# EasyEDA Pro project ProProject_aDataFlow_v2_pub_2024-01-13.epro, board PCB_main_2.51
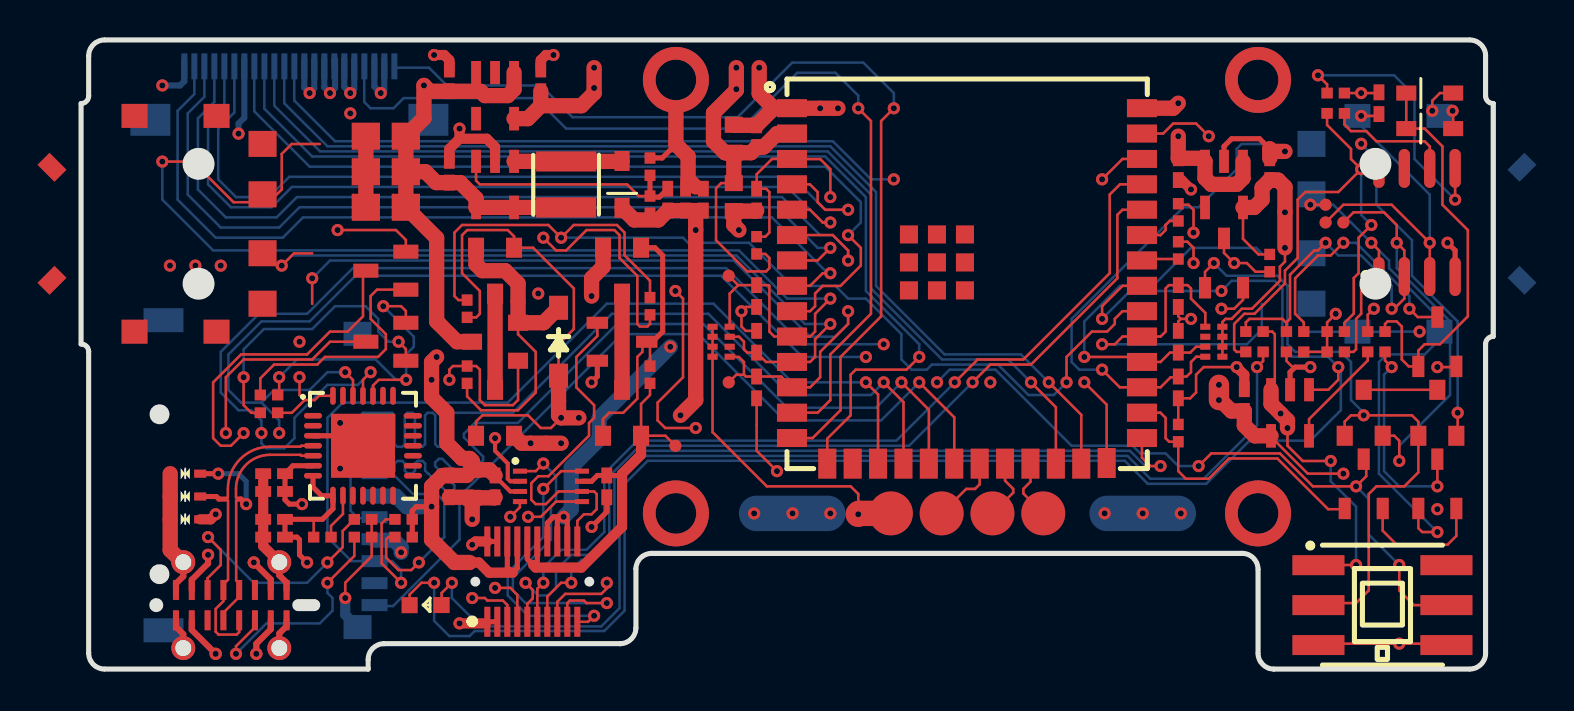
[diagram p11: board, top side]
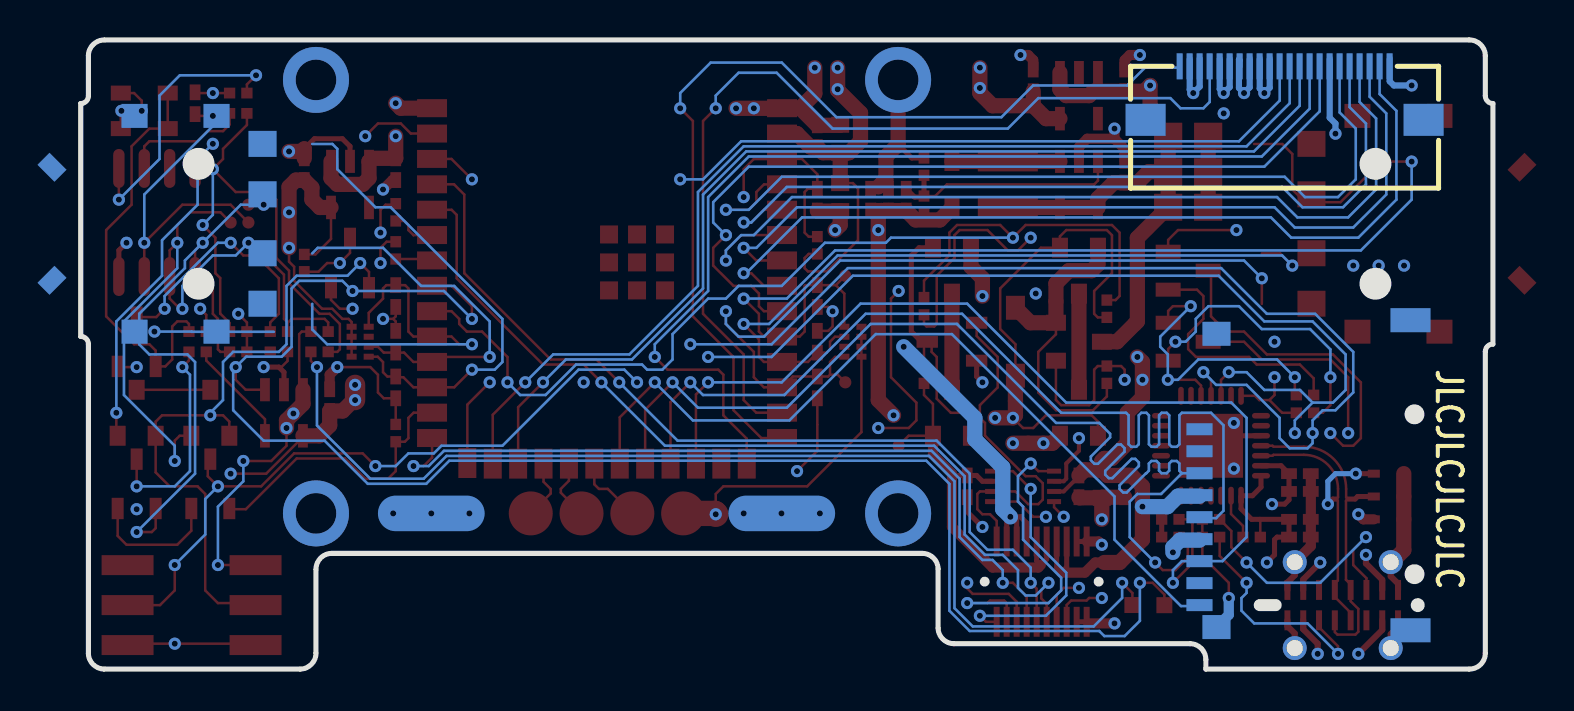
[diagram p12: board, bottom side, seen from below]

Outline 70.61 x 31.49 mm; copper layers: Top Layer, Inner1, Inner2, Bottom Layer. Coordinates in mm from the lower left corner of the outline.
Outline path: 0,28.31 0,16.27 arc(0.27,16.15) 0.38,15.89 0.38,0.79 arc(0.61,0.23) 1.17,0 14.36,0 14.36,0.48 arc(14.59,1.04) 15.15,1.27 26.95,1.27 arc(27.51,1.5) 27.74,2.06 27.74,5 arc(27.98,5.56) 28.54,5.79 58.06,5.79 arc(58.62,5.56) 58.85,5 58.85,0.79 arc(59.08,0.23) 59.65,0 69.44,0 arc(70,0.23) 70.23,0.79 70.23,16.27 arc(70.34,16.54) 70.61,16.65 70.61,28.31 arc(70.34,28.42) 70.23,28.69 70.23,30.69 arc(70,31.25) 69.44,31.49 1.17,31.49 arc(0.61,31.25) 0.38,30.69 0.38,28.69 arc(0.27,28.42) 0,28.31
Stack: Top Layer 0.035mm 外层铜厚1oz / Dielectric1 0.2104mm 7628 RC49% 8.6mil / Inner1 0.0152mm 内层铜厚 / Dielectric2 1.065mm 1.1mm H/HOZ 含铜 / Inner2 0.0152mm 内层铜厚 / Dielectric3 0.2104mm 7628 RC49% 8.6mil / Bottom Layer 0.035mm 外层铜厚1oz

## Design rules (mm)
net USB_DN: DP1
net USB_DP: DP1
template: JLCPCB Capability(Two Layers Board)
spacing copperThickness1oz (default): track to track 0.102, other pairs 0.152 to 0.3
spacing copperThickness2oz: track to track 0.203, other pairs 0.152 to 0.3
track width copperThickness1oz (default): min 0.127, default 0.254, max 2.54
track width copperThickness2oz: min 0.203, default 0.254, max 2.54
differential pair differentialPair (default): width min 0.127, default 0.254, max 2.54; gap min 0.152, default 0.152
via viaSize (default): diameter min 0.5, default 0.61, max 10; hole min 0.3, default 0.305, max 6.3

## Placement (name value [footprint] x y rotation side)
C1  10uF  [C0603]  32.64 26.54 270 top
C2  10uF  [C0603]  32.64 23.62 90 top
C3  100nF  [C0402]  33.78 26.67 270 top
C4  1uF  [C0402]  58.17 13.46 270 top
C5  1uF  [C0402]  33.78 23.5 270 top
C6  10uF  [C0603]  19.56 9.27 90 top
C7  100nF  [C0402]  18.42 9.14 90 top
C8  4.7uF  [C0402]  64.9 28.32 90 top
C9  100nF  [C0402]  54.86 18.67 270 top
C10  100nF  [C0402]  54.86 16.38 90 top
C11  100nF  [C0402]  54.86 14.1 270 top
C12  4.7uF  [C0402]  9.65 9.78 180 top
C13  100nF  [C0402]  9.65 8.89 180 top
C14  1uF  [C0402]  9.65 6.6 180 top
C15  100nF  [C0402]  9.65 7.49 180 top
C16  100nF  [C0402]  33.78 14.1 270 top
C17  100nF  [C0402]  33.78 16.38 90 top
C18  100nF  [C0402]  33.78 18.67 270 top
C19  100nF  [C0402]  20.7 9.14 270 top
C20  100nF  [C0402]  26.29 9.14 90 top
C21  47uF  [C0805]  15.24 23.11 0 top
C22  47uF  [C0805]  15.24 24.89 0 top
C23  47uF  [C0805]  15.24 26.67 0 top
C24  4.7uF  [C0402]  18.42 24.89 270 top
C25  22pF  [C0402]  29.34 23.5 270 top
C26  4.7uF  [C0402]  31.11 23.5 270 top
C27  4.7uF  [C0402]  30.23 23.5 270 top
C28  1uF  [C0402]  54.86 25.02 270 top
C29  1uF  [C0402]  18.42 29.46 90 top
C30  1uF  [C0402]  59.44 25.02 270 top
C31  1uF  [C0402]  22.99 29.46 270 top
CARD1  TF-01A  [TF-SMD_TF-01A]  9.4 9.7 90 bottom
CN1  X0509WVS-20AS-LPV01  [CONN-SMD_20P-P0.50_XKB_X0509WVS-20ADS-LPV01]  22.56 4.38 0 top
D1  1N5819WS  [SOD-323_L1.8-W1.3-LS2.5-RD]  67.44 28.83 0 top
D2  1N5819WS  [SOD-323_L1.8-W1.3-LS2.5-RD]  67.44 27.05 0 top
D3  LESD5D5.0CT1G  [SOD-523_L1.2-W0.8-LS1.6-BI]  5.21 9.78 180 top
D4  LESD5D5.0CT1G  [SOD-523_L1.2-W0.8-LS1.6-BI]  5.21 8.64 180 top
D5  LESD5D5.0CT1G  [SOD-523_L1.2-W0.8-LS1.6-BI]  5.21 7.49 180 top
D6  B5819W SL  [SOD-123_L2.7-W1.6-LS3.7-RD-1]  23.88 16.38 270 top
D7  1N5819WS  [SOD-323_L1.8-W1.3-LS2.5-RD]  27.05 24.26 90 top
FPC1  AFC01-S22FCA-00  [FPC-SMD_P0.5-22P_FGS-XJ-H2.0]  10.42 28.83 0 bottom
L1  10uH  [IND-SMD_L3.0-W3.0_SWPA3010S]  24.26 24.26 270 top
LDO1  ME6211C33M5G-N  [SOT-23-5_L3.0-W1.7-P0.95-LS2.8-BL]  57.15 24.26 180 top
LDO2  ME6211C33M5G-N  [SOT-23-5_L3.0-W1.7-P0.95-LS2.8-BL]  20.7 28.7 180 top
LED1  KT-0603R  [LED0603-RD]  17.23 3.2 0 top
NOREF  -  [Pad_e7534]  6.73 0.76 0 top
NOREF#2  -  [Pad_e9575]  62.23 23.24 0 top
NOREF#3  -  [Pad_e7532]  6.35 5.72 0 top
NOREF#4  -  [Pad_e7497]  25.02 28.19 0 top
NOREF#5  -  [Pad_e7547]  31.62 26.42 0 top
NOREF#6  -  [Pad_e8831]  32.39 19.69 0 top
NOREF#7  -  [Pad_e7535]  8.76 0.76 0 top
NOREF#8  -  [Pad_e93]  35.56 7.79 0 top
NOREF#9  -  [Pad_e7499]  30.73 13.46 0 top
NOREF#10  -  [Pad_e7533]  8.64 5.33 0 top
NOREF#11  -  [Pad_e8787]  32.39 14.35 0 top
NOREF#12  -  [Pad_e7548]  54.86 25.56 0 top
NOREF#13  -  [Pad_e9576]  63.12 22.35 0 top
NOREF#14  -  [Pad_e9577]  62.23 22.35 0 top
NOREF#15  -  [Pad_e84]  53.09 7.79 0 top
NOREF#16  -  [Pad_e7501]  23.88 13.42 0 top
NOREF#17  -  [Pad_e7519]  23.24 11.3 0 top
NOREF#18  -  [Pad_e7496]  17.91 17.27 0 top
NOREF#19  -  [Pad_e7505]  21.85 18.4 0 top
NOREF#20  -  [Pad_e71]  18.29 12.83 0 top
NOREF#21  -  [Pad_e115]  29.72 11.18 0 top
Q1  AO3401A  [SOT-23_L2.9-W1.3-P1.90-LS2.4-BR]  64.14 12.83 270 top
Q2  AO3401A  [SOT-23_L2.9-W1.3-P1.90-LS2.4-BR]  67.82 12.83 270 top
Q3  AO3400A  [SOT-23-3_L2.9-W1.6-P1.90-LS2.8-BR]  67.82 9.27 270 top
Q4  AO3400A  [SOT-23-3_L2.9-W1.6-P1.90-LS2.8-BR]  67.82 16.38 270 top
Q5  SS8050  [SOT-23-3_L2.9-W1.3-P1.90-LS2.4-BR]  15.24 19.94 0 top
Q6  SS8050  [SOT-23-3_L2.9-W1.3-P1.90-LS2.4-BR]  15.24 16.38 0 top
Q7  AO3401A  [SOT-23_L2.9-W1.3-P1.90-LS2.4-BR]  27.05 12.83 270 top
Q8  AO3401A  [SOT-23_L2.9-W1.3-P1.90-LS2.4-BR]  27.05 19.94 90 top
Q9  AO3401A  [SOT-23_L2.9-W1.3-P1.90-LS2.4-BR]  20.7 16.38 0 top
Q10  AO3401A  [SOT-23_L2.9-W1.3-P1.90-LS2.4-BR]  20.7 12.83 270 top
Q11  AO3401A  [SOT-23_L2.9-W1.3-P1.90-LS2.4-BR]  20.7 19.94 90 top
Q12  AO3400A  [SOT-23-3_L2.9-W1.6-P1.90-LS2.8-BR]  27.05 16.38 180 top
Q13  AO3400A  [SOT-23-3_L2.9-W1.6-P1.90-LS2.8-BR]  64.14 9.27 270 top
Q14  AO3400A  [SOT-23-3_L2.9-W1.6-P1.90-LS2.8-BR]  57.15 20.32 270 top
R1  10kΩ  [R0402]  33.78 21.21 270 top
R2  510Ω  [R0402]  54.86 22.86 90 top
R3  10kΩ  [R0402]  16.13 7.49 0 top
R4  100kΩ  [R0402]  58.67 16.89 0 top
R5  510Ω  [R0402]  54.86 20.95 270 top
R6  10kΩ  [R0402]  16.13 6.6 0 top
R7  5.1kΩ  [R0402]  64.77 15.88 0 top
R8  100kΩ  [R0402]  60.71 16.89 180 top
R9  1kΩ  [R0402]  58.67 15.88 0 top
R10  10kΩ  [R0402]  64.77 16.89 0 top
R11  47kΩ  [R0402]  62.74 15.88 0 top
R12  10kΩ  [R0402]  9.4 13.72 180 top
R13  10kΩ  [R0402]  62.74 27.81 0 top
R14  5.1kΩ  [R0402]  14.1 6.6 0 top
R15  10kΩ  [R0402]  62.74 28.83 180 top
R16  5.1kΩ  [R0402]  14.1 7.49 180 top
R17  10kΩ  [R0402]  9.4 12.83 180 top
R18  4.7kΩ  [R0402]  62.74 16.89 180 top
R19  6.8kΩ  [R0402]  60.71 15.88 180 top
R20  10kΩ  [R0402]  12.06 6.6 0 top
R21  10kΩ  [R0402]  28.45 14.73 270 top
R22  300kΩ  [R0402]  28.45 23.24 270 top
R23  10kΩ  [R0402]  19.3 14.73 270 top
R24  1kΩ  [R0402]  19.3 18.03 90 top
R25  1.5kΩ  [R0402]  28.45 18.16 270 top
R26  100kΩ  [R0402]  28.45 25.15 90 top
R27  10kΩ  [R0402]  59.44 20.32 270 top
R28  10kΩ  [R0402]  54.86 11.81 270 top
RN1  10kΩ  [RES-ARRAY-SMD_0402-8P-L2.0-W1.0-BL]  56.64 16.38 270 top
RN2  10kΩ  [RES-ARRAY-SMD_0402-8P-L2.0-W1.0-BL]  32 16.38 90 top
SW1  XKB5858-Z-TP-75  [SW-SMD_6P-L5.8-W5.8-P2.00-LS8.3]  65.07 3.2 0 top
U1  ESP32-S3-WROOM-1U-N4R2  [WIRELM-SMD_ESP32-S3-WROOM-1U]  44.3 19.18 0 top
U2  TP4054-42-SOT25R  [SOT-23-5_L3.0-W1.7-P0.95-LS2.8-BL]  60.45 12.83 180 top
U3  LM393DR2G  [SOIC-8_L5.0-W4.0-P1.27-LS6.0-BL]  66.8 22.35 0 top
U4  SIQ-02FVS3  [SW-SMD_SIQ-02FVS3_1]  66.79 22.29 90 bottom
U5  CP2102-GMR  [WQFN-28_L5.0-W5.0-P0.50-BL-EP3.2]  14.1 11.18 270 top
U6  SIQ-02FVS3  [SW-SMD_SIQ-02FVS3_1]  3.81 22.29 90 top
U7  TXS0102DCUR  [VSON8_L2.0-W2.3-P0.50-LS3.1-BL]  23.49 9.14 270 top
U8  YTC1P-4020-01  [TESTPOINT-SMD_BD2.0_YTC1P-4020-01]  40.49 7.79 0 top
U9  YTC1P-4020-01  [TESTPOINT-SMD_BD2.0_YTC1P-4020-01]  43.03 7.79 0 top
U10  YTC1P-4020-01  [TESTPOINT-SMD_BD2.0_YTC1P-4020-01]  45.57 7.79 0 top
U11  TPS61040DBVR  [SOT-23-5_L3.0-W1.7-P0.95-LS2.8-BL]  20.7 24.26 180 top
U12  YTC1P-4020-01  [TESTPOINT-SMD_BD2.0_YTC1P-4020-01]  48.11 7.79 0 top
USB1  GT-USB-7051A  [USB-C-SMD_GT-USB-7051A]  7.51 3.2 0 top

## Footprints (pads in the part's own frame, mm; a bottom-side part is the same pattern mirrored in y, then rotated)
C0402
  rect 0.79x0.54 smd: 1(-0.545,0) 2(0.545,0)
C0603
  rect 0.8x0.9 smd: 1(-0.7,0) 2(0.7,0)
C0805
  rect 1.41x1.35 smd: 1(-1,0) 2(1,0)
CONN-SMD_20P-P0.50_XKB_X0509WVS-20ADS-LPV01
  rect 0.3x1.5 smd: 1(-2.25,-2.01) 2(-2.25,2.01) 3(-1.75,-2.01) 4(-1.75,2.01) 5(-1.25,-2.01) 6(-1.25,2.01) 7(-0.75,-2.01) 8(-0.75,2.01) 9(-0.25,-2.01) 10(-0.25,2.01) 11(0.25,-2.01) 12(0.25,2.01) 13(0.75,-2.01) 14(0.75,2.01) 15(1.25,-2.01) 16(1.25,2.01) 17(1.75,-2.01) 18(1.75,2.01) 19(2.25,-2.01) 20(2.25,2.01)
FPC-SMD_P0.5-22P_FGS-XJ-H2.0
  rect 0.3x1.3 smd: 1(-5.252,-1.338) 2(-4.752,-1.338) 3(-4.252,-1.338) 4(-3.752,-1.338) 5(-3.252,-1.338) 6(-2.752,-1.338) 7(-2.252,-1.338) 8(-1.752,-1.338) 9(-1.25,-1.339) 10(-0.752,-1.338) 11(-0.252,-1.338) 12(0.248,-1.338) 13(0.748,-1.338) 14(1.248,-1.338) 15(1.748,-1.338) 16(2.248,-1.338) 17(2.748,-1.338) 18(3.248,-1.338) 19(3.748,-1.338) 20(4.25,-1.339) 21(4.748,-1.338) 22(5.248,-1.338)
  rect 2x1.6 smd: 23(6.95,1.339) 24(-6.95,1.339)
IND-SMD_L3.0-W3.0_SWPA3010S
  rect 1x3 smd: 1(1.15,0) 2(-1.15,0)
LED0603-RD
  rect 0.8x0.8 smd: 1(-0.799,-0.004) 2(0.799,0.004)
Pad_e71
  round 0.61 smd: TP1(0,0)
Pad_e84
  oval 5.334x1.778 smd far side: 42(0,0)
Pad_e93
  oval 5.334x1.778 smd far side: 42(0,0)
Pad_e115
  round 0.61 smd: TP5(0,0)
Pad_e7496
  round 0.61 smd: TP2(0,0)
Pad_e7497
  round 0.61 smd: TP3(0,0)
Pad_e7499
  round 0.61 smd: TP5(0,0)
Pad_e7501
  round 0.61 smd: TP7(0,0)
Pad_e7505
  round 0.61 smd: TP8(0,0)
Pad_e7519
  round 0.61 smd: TP10(0,0)
Pad_e7532
  round 0.61 smd: TP16(0,0)
Pad_e7533
  round 0.61 smd: TP17(0,0)
Pad_e7534
  round 0.61 smd: TP18(0,0)
Pad_e7535
  round 0.61 smd: TP19(0,0)
Pad_e7547
  round 0.61 smd: TP31(0,0)
Pad_e7548
  round 0.61 smd: TP32(0,0)
Pad_e8787
  round 0.61 smd: TP22(0,0)
Pad_e8831
  round 0.61 smd: TP25(0,0)
Pad_e9575
  round 0.61 smd: TP1(0,0)
Pad_e9576
  round 0.61 smd: TP2(0,0)
Pad_e9577
  round 0.61 smd: TP3(0,0)
R0402
  rect 0.566x0.54 smd: 1(-0.433,0) 2(0.433,0)
RES-ARRAY-SMD_0402-8P-L2.0-W1.0-BL
  rect 0.3x0.505 smd: 1(-0.75,0.427) 2(-0.25,0.427) 3(0.25,0.427) 4(0.75,0.427) 5(0.75,-0.427) 6(0.25,-0.427) 7(-0.25,-0.427) 8(-0.75,-0.427)
SOD-123_L2.7-W1.6-LS3.7-RD-1
  rect 1.2x0.95 smd: 1(-1.7,0) 2(1.7,0)
SOD-323_L1.8-W1.3-LS2.5-RD
  rect 1x0.75 smd: 1(-1.173,0) 2(1.173,0)
SOD-523_L1.2-W0.8-LS1.6-BI
  rect 0.6x0.4 smd: 1(-0.75,0) 2(0.75,0)
SOIC-8_L5.0-W4.0-P1.27-LS6.0-BL
  oval 0.569x1.95 smd: 1(-1.905,-2.705) 2(-0.635,-2.705) 3(0.635,-2.705) 4(1.905,-2.705) 5(1.905,2.705) 6(0.635,2.705) 7(-0.635,2.705) 8(-1.905,2.705)
SOT-23-3_L2.9-W1.3-P1.90-LS2.4-BR
  rect 1.25x0.7 smd: 1(1,-0.95) 2(1,0.95) 3(-1,0)
SOT-23-3_L2.9-W1.6-P1.90-LS2.8-BR
  rect 1.07x0.6 smd: 1(1.235,-0.95) 2(1.235,0.95) 3(-1.235,0)
SOT-23-5_L3.0-W1.7-P0.95-LS2.8-BL
  rect 0.49x1.157 smd: 1(-0.95,-1.153) 2(0,-1.153) 3(0.95,-1.153)
  rect 0.49x1.175 smd: 4(0.95,1.153) 5(-0.95,1.153)
SOT-23_L2.9-W1.3-P1.90-LS2.4-BR
  rect 1x0.8 smd: 1(1.15,-0.95) 2(1.15,0.95) 3(-1.15,0)
SW-SMD_6P-L5.8-W5.8-P2.00-LS8.3
  rect 2.6x1 smd: 1(-3.2,2) 2(-3.2,0) 3(-3.2,-2) 4(3.2,2) 5(3.2,0) 6(3.2,-2)
SW-SMD_SIQ-02FVS3_1
  rect 1.2x1.3 smd: 1(5.4,-2.964) 2(5.4,1.136) 5(-5.4,1.136) 6(-5.4,-2.964)
  rect 0.85x1.2 smd rot 135: 3(2.829,5.264)
  rect 0.85x1.2 smd rot 45: 4(-2.829,5.264)
  rect 1.3x1.4 smd: A(-4,-5.264) B(4,-5.264) C(1.475,-5.264) S(-1.475,-5.264)
TESTPOINT-SMD_BD2.0_YTC1P-4020-01
  round 2.2 smd: 1(0,0)
TF-SMD_TF-01A
  rect 0.6x1.3 smd: 1(2.3,5.276) 2(1.2,5.276) 3(0.101,5.276) 4(-1,5.276) 5(-2.099,5.276) 6(-3.2,5.276) 7(-4.3,5.276) 8(-5.399,5.276) 9(-6.5,5.276)
  rect 1.2x1.4 smd: 10(-7.599,4.426) 13(7.08,4.426)
  rect 1.2x2 smd: 11(-7.76,-5.276) 12(7.76,-5.276)
USB-C-SMD_GT-USB-7051A
  round 1.2 hole 0.8: 0(-2.4,2.15) 0(-2.4,-2.15) 0(2.4,2.15) 0(2.4,-2.15)
  rect 0.3x1 smd: A1(-2.765,0.76) A4(-1.975,0.76) A5(-1.185,0.76) A6(-0.395,0.76) A7(0.395,0.76) A8(1.185,0.76) A9(1.975,0.76) A12(2.765,0.76) B1(2.765,-0.76) B4(1.975,-0.76) B5(1.185,-0.76) B6(0.395,-0.76) B7(-0.395,-0.76) B8(-1.185,-0.76) B9(-1.975,-0.76) B12(-2.765,-0.76)
VSON8_L2.0-W2.3-P0.50-LS3.1-BL
  rect 0.25x0.7 smd: 1(-0.762,-1.55) 2(-0.254,-1.55) 3(0.254,-1.55) 4(0.762,-1.55) 5(0.762,1.55) 6(0.254,1.55) 7(-0.254,1.55) 8(-0.762,1.55)
WIRELM-SMD_ESP32-S3-WROOM-1U
  rect 1.5x0.9 smd: 1(-8.75,8.895) 2(-8.75,7.625) 3(-8.75,6.355) 4(-8.75,5.085) 5(-8.75,3.815) 6(-8.75,2.545) 7(-8.75,1.275) 8(-8.75,0.005) 9(-8.75,-1.265) 10(-8.75,-2.535) 11(-8.75,-3.805) 12(-8.75,-5.075) 13(-8.75,-6.345) 14(-8.75,-7.615) 27(8.75,-7.615) 28(8.75,-6.345) 29(8.75,-5.075) 30(8.75,-3.805) 31(8.75,-2.535) 32(8.75,-1.265) 33(8.75,0.005) 34(8.75,1.275) 35(8.75,2.545) 36(8.75,3.815) 37(8.75,5.085) 38(8.75,6.355) 39(8.75,7.625) 40(8.75,8.895)
  rect 0.9x1.5 smd: 15(-6.985,-8.895) 16(-5.715,-8.895) 17(-4.445,-8.895) 18(-3.175,-8.895) 19(-1.905,-8.895) 20(-0.635,-8.895) 21(0.635,-8.895) 22(1.905,-8.895) 23(3.175,-8.895) 24(4.445,-8.895) 25(5.715,-8.895) 26(6.985,-8.865)
  rect 0.9x0.9 smd: 41(-2.9,2.575) 41(-2.9,1.175) 41(-2.9,-0.225) 41(-1.5,2.575) 41(-1.5,1.175) 41(-1.5,-0.225) 41(-0.1,2.575) 41(-0.1,1.175) 41(-0.1,-0.225)
WQFN-28_L5.0-W5.0-P0.50-BL-EP3.2
  oval 0.28x0.9 smd: 1(-1.502,-2.5) 2(-1.001,-2.5) 3(-0.5,-2.5) 4(0,-2.5) 5(0.5,-2.5) 6(1,-2.5) 7(1.501,-2.5) 15(1.501,2.5) 16(1,2.5) 17(0.5,2.5) 18(0,2.5) 19(-0.5,2.5) 20(-1.001,2.5) 21(-1.502,2.5)
  oval 0.9x0.28 smd: 8(2.5,-1.502) 9(2.5,-1.001) 10(2.5,-0.5) 11(2.5,0) 12(2.5,0.5) 13(2.5,1) 14(2.5,1.501) 22(-2.5,1.501) 23(-2.5,1) 24(-2.5,0.5) 25(-2.5,0) 26(-2.5,-0.5) 27(-2.5,-1.001) 28(-2.5,-1.502)
  rect 3.2x3.2 smd: 29(0,0)

## Nets
As in the schematic, except:
3V3: C6.2 C7.2 C19.1 C30.2 CARD1.4 CN1.6 CN1.8 FPC1.7 LDO1.5 NOREF#20.TP1 R3.2 R6.2 R27.1 RN1.1 RN1.2 RN1.3 RN1.4 RN2.1 RN2.2 RN2.3 RN2.4 U7.3 U8.1
3V3_2: C1.2 C2.2 C3.2 C31.2 LDO2.5 NOREF#4.TP3 NOREF#5.TP31 R1.2 U1.2
5V_USB: C4.2 C14.1 C15.1 D1.2 D5.1 D6.2 NOREF.TP18 NOREF#3.TP16 NOREF#7.TP19 NOREF#10.TP17 NOREF#16.TP7 Q10.1 Q11.1 R20.1 R24.1 U2.4 U5.7 U5.8 USB1.A4 USB1.A9 USB1.B4 USB1.B9
+5V: C25.2 C26.2 C27.2 CN1.2 CN1.4 D7.1 FPC1.13 FPC1.14 FPC1.15 FPC1.16 NOREF#9.TP5 R22.2
GND: C1.1 C2.1 C3.1 C4.1 C5.2 C6.1 C7.1 C8.2 C9.2 C10.2 C11.2 C12.2 C13.2 C14.2 C15.2 C16.2 C17.2 C18.2 C19.2 C20.1 C21.1 C22.1 C23.1 C24.1 C26.1 C27.1 C28.2 C29.2 C30.1 C31.1 CARD1.6 CARD1.10 CARD1.11 CARD1.12 CARD1.13 CN1.1 CN1.3 D3.2 D4.2 D5.2 FPC1.1 FPC1.17 FPC1.18 FPC1.20 FPC1.21 FPC1.23 FPC1.24 LDO1.2 LDO2.2 NOREF#15.42 Q3.2 Q4.2 Q12.2 Q13.2 Q14.2 R10.1 R14.2 R15.1 R16.1 R19.2 R25.2 R26.2 R28.1 SW1.3 SW1.6 U1.1 U1.40 U1.41 U2.2 U3.4 U4.1 U4.2 U4.3 U4.4 U4.5 U4.6 U4.C U5.3 U5.29 U6.1 U6.2 U6.3 U6.4 U6.5 U6.6 U6.C U7.2 U11.2 USB1.0 USB1.A1 USB1.A12 USB1.B1 USB1.B12
VBAT: NOREF#8.42 NOREF#17.TP10 Q10.2 R4.2 SW1.1 U2.3
VCC: C21.2 C22.2 C23.2 C24.2 C28.1 C29.1 D2.2 L1.1 LDO1.1 LDO1.3 LDO2.1 LDO2.3 NOREF#12.TP32 NOREF#18.TP2 Q9.3 U11.4 U11.5
CHARGE_EN: NOREF#2.TP1 Q3.1 R11.2 U3.1
COMP_BATT: NOREF#13.TP2 Q1.2 R4.1 R8.2 U3.2
ENC_BANDRATE_A: C16.1 NOREF#11.TP22 RN2.8 U1.12 U6.A
ENC_BANDRATE_B: C18.1 NOREF#6.TP25 RN2.5 U1.10 U6.B
VOUT_PRE: C20.2 CN1.10 CN1.12 NOREF#21.TP5 Q7.2 R21.2 U7.7
$1N2499: D6.1 NOREF#19.TP8 Q9.2 Q11.2 R23.2
$1N99677: C8.1 NOREF#14.TP3 R11.1 R18.2 R19.1 U3.3

Pads without a net: CARD1 1 2 8; LDO1 4; LDO2 4; RN1 7; RN2 7; SW1 4; U1 16; U3 7; U5 1 2 10 11 12 13 14 15 16 17 18 19 20 21 22 23 27; USB1 A8 B8

## Via types
v1: diameter 0.61, hole 0.305, Top Layer to Bottom Layer, 197 vias
v2: diameter 3.302, hole 2.032, Top Layer to Bottom Layer, 4 vias

## Routing (per net, layer and track width the routed paths; a pad name or vN(x,y) marks a point on that pad's centre or on a via; arc(x,y) is an arc through that point)
3V3: length 168.2
  Top Layer w0.127: v1(60.2,21.08) 60.2,20.39 59.94,20.14 59.94,19.43 58.55,18.03 58.04,18.03 57.53,17.53 57.22,17.53 57.07,17.37 RN1.1 RN1.2 RN1.3 RN1.4 ; R27.1 58.88,20.75 58.1,21.53 LDO1.5 ; RN2.4 RN2.3 RN2.2 RN2.1 31.58,11.86 34.29,9.14 38.48,9.14 38.86,8.76 v1(38.86,7.75)
  Top Layer w0.203: U7.3 21.46,8.89 20.7,9.65 C19.1
  Top Layer w0.254: CN1.8 21.81,5.05 21.59,4.83 21.31,5.1 CN1.6 ; R6.2 R3.2 16.56,7.93 16.76,8.13 v1(17.53,8.13)
  Top Layer w0.508: 19.43,5.33 19.89,5.33 20.4,4.83 21.59,4.83
  Top Layer w0.762: v1(60.2,21.08) v1(60.2,22.86) 60.2,24.13 59.85,24.47 C30.2 59.05,24.09 59.05,23.5 58.66,23.1 LDO1.5 ; C6.2 19.56,10.41 19.43,10.54 19.05,10.54 18.29,11.3 NOREF#20.TP1 17.53,13.59 v1(17.53,14.48) 17.53,15.37 v1(17.78,15.62) ; C6.2 20.42,9.97 C19.1 ; C6.2 19.28,9.69 C7.2 18.07,9.69 17.53,9.14 v1(17.53,8.13) 17.53,6.48 18.67,5.33 19.43,5.33
  Top Layer w1.27: v1(38.86,7.75) 38.9,7.79 U8.1
  Inner2 w0.762: v1(7.87,26.8) 10.41,26.8 17.07,20.14 ; v1(17.53,14.48) 17.53,15.37 v1(17.78,15.62) 17.78,19.43 17.07,20.14 ; v1(38.86,7.75) 42.19,11.07 61.11,11.07 61.6,11.56 61.6,12.57 59.69,14.48 59.69,20.57 v1(60.2,21.08) v1(60.2,22.86) 60.2,24.13 58.93,25.4 33.78,25.4 31.88,23.5 31.88,21.46 30.56,20.14 17.07,20.14
  Bottom Layer w0.305: v1(7.87,26.8) 7.87,27.31 8.16,27.59 8.16,30.55
  Bottom Layer w0.762: v1(17.53,8.13) 16.28,8.13 15.75,8.65 14.67,8.65
3V3_2: length 36
  Top Layer w0.127: R1.2 34.21,20.78 34.42,20.57 34.42,20.07 34.25,19.9 33.31,19.9 31.75,21.46 31.75,24.07 32,24.32 C2.2
  Top Layer w0.762: LDO2.5 22.34,27.55 22.99,28.19 ; C1.2 32.2,25.84 NOREF#5.TP31 31.62,27.83 32.77,28.97 v1(32.77,29.02) v1(32.77,30.1) ; C1.2 33.5,25.84 C3.2 34.13,26.12 34.8,26.8 U1.2 ; C1.2 C2.2 ; 22.99,28.19 NOREF#4.TP3 25.65,28.83 v1(25.65,30.1) ; 22.99,28.19 C31.2
  Inner2 w0.762: v1(32.77,30.1) v1(32.77,29.02) 30.67,26.92 27.69,26.92 25.65,28.96 v1(25.65,29.08) v1(25.65,30.1)
5V_CHK+: length 52.9
  Top Layer w0.127: 19.3,18.47 18.87,18.47 18.67,18.67 18.67,21.84 19.05,22.23 23.37,22.23 v1(24,21.59) 24.64,22.23 26.8,22.23 27.18,21.84 27.18,20.71 28.45,19.44 R25.1 ; v1(49.28,14.35) 49.28,15.62 50.55,16.89 51.31,16.89 51.69,17.27 51.69,17.53 52.08,17.91 U1.32
  Bottom Layer w0.127: v1(49.28,14.35) 48.64,13.72 47.37,13.72 45.85,15.24 42.55,15.24 42.29,14.99 41.53,14.99 41.02,15.49 41.02,16.76 39.24,18.54 38.35,18.54 37.72,19.18 35.56,19.18 33.4,21.34 30.35,21.34 30.1,21.59 v1(24,21.59)
5V_USB: length 166.7
  Top Layer w0.127: v1(24,12.57) 23.49,12.06 22.99,12.06 22.35,12.7 20.07,12.7 19.75,12.39 19.75,11.68 ; v1(67.56,27.94) 67.56,28.45 67.95,28.83 D1.2 ; R24.1 19.76,17.6 19.94,17.78 19.94,18.92 19.05,19.81 19.05,21.72 19.3,21.97 21.34,21.97 21.65,21.66 Q11.1 22.6,21.09 24.64,19.05 24.64,17.02 23.88,16.26 D6.2 ; v1(63.12,9.78) 61.34,9.78 59.5,11.62 U2.4 ; 11.65,7.49 11.63,7.47 R20.1
  Top Layer w0.254: 12.48,8.68 12.03,8.68 11.6,9.1 U5.7 ; v1(11.3,5.33) 10.92,5.72 10.92,6.48 10.8,6.6 C14.1 C15.1 12.06,7.49 12.6,8.02 U5.8
  Top Layer w0.305: USB1.B9 5.54,1.96 v1(6.73,0.76) ; v1(8.76,0.76) 8.76,1.27 9.49,1.99 USB1.B4 ; USB1.A4 5.54,4.47 6.35,5.28 v1(6.35,5.72) ; v1(8.64,5.33) 9.49,4.48 USB1.A9
  Top Layer w0.508: v1(6.73,7.75) 6.48,7.49 D5.1
  Top Layer w0.762: v1(24.89,12.57) v1(24,12.57) 23.88,12.7 NOREF#16.TP7 D6.2 ; v1(56.9,13.46) 56.97,13.46 57.52,12.92 C4.2 58.17,12.19 58.68,11.67 U2.4
  Top Layer w1.016: v1(56.9,14.22) v1(56.9,13.46)
  Inner2 w0.127: v1(63.12,9.78) 63.12,12.57 60.83,14.86 60.83,20.19 61.47,20.83 61.47,21.72 62.48,22.73 63.75,22.73 67.56,26.54 v1(67.56,27.94)
  Inner2 w0.254: v1(6.73,7.75) 7.62,7.75 8,7.37 9.27,7.37 v1(11.3,5.33)
  Inner2 w0.508: v1(8.64,5.33) 8.64,4.32 7.81,3.49 6.35,4.95 v1(6.35,5.72) ; v1(8.76,0.76) 8.76,1.48 8.34,1.91 7.87,1.91 v1(6.73,0.76)
  Inner2 w1.016: 4.7,7.75 4.7,11.18 6.98,13.46 23.11,13.46 v1(24,12.57) v1(24.89,12.57) 25.91,12.57 28.32,14.99 31.5,14.99 33.27,13.21 56.64,13.21 v1(56.9,13.46) ; 4.7,7.75 v1(6.73,7.75) ; 4.7,7.75 2.77,5.81 arc(2.03,4.72) 1.78,3.43 1.78,2.79 arc(2.15,1.9) 3.05,1.52 3.14,1.52 arc(3.64,1.62) 4.06,1.91 arc(4.91,2.47) 5.9,2.67 7.49,2.67 ; 7.49,2.67 7.87,2.29 7.87,1.91 ; 7.49,2.67 7.81,2.98 7.81,3.49
  Inner2 w1.27: v1(56.9,14.22) v1(56.9,13.46)
+5V: length 62.3
  Top Layer w0.254: CN1.4 CN1.2
  Top Layer w0.508: CN1.2 19.72,6.39 v1(19.56,6.22)
  Top Layer w0.762: 30.58,22.95 30.73,22.8 v1(30.73,21.97) NOREF#9.TP5 v1(29.97,12.7) ; 30.58,22.95 30.82,22.95 ; 30.58,22.95 C27.2 C25.2 28.87,22.48 27.66,22.48 D7.1
  Inner2 w0.508: v1(12.45,28.83) 12.45,28.32 12.15,28.03 11.94,28.03 11.43,28.53 v1(11.43,28.83)
  Inner2 w0.762: v1(29.97,12.7) 26.54,9.27 26.54,6.73 26.04,6.22 v1(19.56,6.22) ; 11.98,28.03 11.98,27.14 14.1,25.02 27.69,25.02 v1(30.73,21.97)
  Bottom Layer w0.305: 11.66,30.55 11.66,29.06 v1(11.43,28.83) 11.16,29.1 11.16,30.55 ; 12.16,30.55 12.16,29.11 v1(12.45,28.83) 12.7,29.08 12.7,30.51 12.67,30.48 FPC1.16
GND: length 138.2
  Top Layer w0.127: C16.2 33.78,10.92 v1(34.8,9.91) ; v1(67.82,15.11) 68.61,15.11 68.77,15.28 ; v1(55.5,17.53) 54.99,17.53 ; 54.99,17.53 54.86,17.4 C10.2 ; 54.99,17.53 54.86,17.65 C9.2 ; Q13.2 65.08,6.92 65.79,6.22 68.33,6.22 68.77,6.67 Q3.2 ; R25.2 28.45,17.27 28.32,17.14 27.94,17.14 27.81,17.27 27.81,19.69 26.92,20.57 26.92,21.72 26.67,21.97 25.27,21.97 24.26,20.95 23.75,20.95 v1(23.11,21.59) ; C8.2 64.86,28.83 v1(64.01,28.83) 63.17,28.83 ; C18.2 33.24,18.12 v1(33.02,17.91) 33.02,17.14 33.24,16.93 C17.2 ; v1(57.79,15.11) 56.13,15.11 55.75,14.73 55.75,13.84 55.46,13.55 C11.2 54.86,12.37 ; 61.7,1.2 61.77,1.27 v1(65.91,1.27) 68.38,1.27 68.45,1.2 ; R10.1 64.34,17.73 v1(64.64,18.03) ; R16.1 R14.2 14.53,5.64 13.21,4.32 v1(13.21,3.56) ; v1(57.02,18.03) 57.66,18.03 58.1,18.48 Q14.2 ; R19.2 60.27,15.42 60.58,15.11 60.71,15.11
  Top Layer w0.203: U7.2 21.46,9.4 21.34,9.53 21.34,10.29 20.7,10.92 v1(20.7,11.56)
  Top Layer w0.254: v1(68.33,21.34) 68.71,20.95 U3.4 ; v1(25.53,14.35) 25.82,14.64 25.82,15.43 ; U5.3 13.6,11.68 U5.29 ; 59.44,26.03 58.93,26.54 57.53,26.54 57.15,26.16 LDO1.2 ; v1(61.47,15.11) 60.71,15.11 60.45,14.86 60.45,13.98 ; 29.74,26.26 29.06,25.58 R26.2 ; v1(25.53,7.11) 26.29,7.87 C20.1 ; CN1.3 CN1.1
  Top Layer w0.305: USB1.A1 4.75,4.28 5.11,4.64 USB1.0 ; USB1.0 9.91,4.69 10.28,4.33 USB1.A12 ; USB1.0 5.11,1.75 4.75,2.11 USB1.B12 ; USB1.B1 10.28,2.15 9.91,1.78 USB1.0
  Top Layer w0.508: C29.2 18.42,30.48 18.16,30.73 v1(17.65,30.73) ; USB1.0 9.11,6.15 9.11,9.78 ; C24.1 18.42,26.03 18.92,26.54 ; v1(18.92,27.05) 18.92,26.54 ; 18.92,26.54 20.29,26.54 20.7,26.13 U11.2 ; C31.1 22.99,30.48 23.24,30.73 v1(23.62,30.73) ; v1(18.92,2.29) 20.23,2.29 ; v1(57.79,15.11) 58.17,14.73 C4.1 ; v1(55.5,24) 55.03,24.47 C28.2
  Top Layer w0.762: C6.1 19.53,8.6 C7.1 ; C6.1 v1(19.56,7.49) ; C6.1 20.67,8.57 C19.2 ; v1(60.2,25.91) 59.56,25.91 59.44,26.03 C30.1 ; 34.64,28.07 U1.1 35.55,28.07 v1(36.96,28.07) v1(37.85,28.07) ; 34.64,28.07 33.91,28.8 v1(33.91,30.1) ; 34.64,28.07 C3.1 32.67,27.22 C1.1 ; v2(29.74,29.49) 29.74,26.26 30.35,25.65 30.35,24.51 30.73,24.13 ; C5.2 33.75,22.92 C2.1 32.64,22.23 v1(32.89,21.97) ; U1.40 54.61,28.07 v1(54.86,28.32) ; USB1.0 5.06,5.35 4.46,5.96 D5.2 D4.2 D3.2 ; C21.1 C22.1 C23.1
  Bottom Layer w0.127: v1(66.93,16.89) 65.07,16.89 65.06,16.88 60.96,16.88
  Bottom Layer w0.305: v1(4.06,29.21) 4.95,29.21 5.16,29.42 5.16,30.55 ; 13.66,30.55 13.66,29.03 v1(13.46,28.83) 13.16,29.13 13.16,30.55 ; 15.16,30.55 15.16,29.01 v1(14.99,28.83) 14.66,29.15 14.66,30.55
  Bottom Layer w0.508: v1(13.21,3.56) 13.21,2.72 CARD1.10
  Bottom Layer w0.762: v1(16,5.84) 16,6.1 15.64,6.45 14.67,6.45
  vias: v1(10.92,16.38) v1(12.95,12.32) v1(12.95,10.03) v1(22.86,18.8) v1(45.47,14.35) v1(51.18,7.79) v1(53.09,7.79) v1(54.99,7.79) v1(67.82,8) v2(29.74,7.79) v2(58.85,29.49) v2(58.85,7.79)
VBAT: length 65.5
  Top Layer w0.127: v1(62.48,10.41) 61.09,10.41 60.33,11.18 v1(60.33,12.06) ; 61.7,5.2 61.7,5.21 v1(63.75,5.21) ; 59.5,13.98 59.69,14.17 59.69,16.76 59.56,16.89 59.11,16.89
  Top Layer w0.762: 59.5,13.98 59.5,13.27 v1(59.98,12.79) 60.33,12.45 v1(60.33,12.06) ; v1(24,11.3) NOREF#17.TP10 v1(22.48,11.3) 22.02,11.3 21.65,11.68
  Inner2 w0.762: v1(60.33,12.06) 60.33,12.45 59.94,12.83 58.04,12.83 57.28,12.06 41.74,12.06 v1(37.46,7.79) v1(35.58,7.79) v1(33.65,7.79) 32.99,8.45 32.99,11.84 30.91,13.92 28.9,13.92 26.29,11.3 v1(24,11.3) v1(22.48,11.3)
  Bottom Layer w0.127: v1(62.48,10.41) 62.48,9.4 63.75,8.13 v1(63.75,5.21)
VCC: length 94.8
  Top Layer w0.127: D2.2 68.61,27.72 68.58,27.75 v1(68.58,27.94)
  Top Layer w0.762: C22.2 C21.2 17.78,21.57 17.78,17.4 NOREF#18.TP2 18.8,16.38 Q9.3 ; C22.2 17.22,24.89 17.76,24.35 C24.2 18.96,24.35 19.75,23.56 U11.4 U11.5 24.25,23.1 L1.1 ; C22.2 C23.2 17.14,27.58 v1(17.14,29.21) 17.44,28.92 C29.1 19.98,28.92 20.19,28.7 21.34,28.7 21.65,29.02 LDO2.1 ; LDO1.1 58.1,24.57 57.79,24.26 56.52,24.26 56.2,24.57 LDO1.3 56.05,25.56 NOREF#12.TP32 v1(54.86,26.67)
  Inner2 w0.127: v1(68.58,27.94) 68.58,28.96 67.95,29.59 63.63,29.59 63.12,29.08 63.12,28.07 62.36,27.31 55.5,27.31 v1(54.86,26.67)
  Inner2 w0.762: v1(17.14,29.21) 17.14,26.42 17.65,25.91 32.37,25.91 33.13,26.67 v1(54.86,26.67)
VCC_3V3_FROM_USB: length 109.8
  Top Layer w0.127: R9.1 57.79,15.88 57.66,16 57.66,17.27 58.17,17.78 58.67,17.78 60.2,19.3 60.2,19.94 60.83,20.57 60.83,23.5 61.21,23.88 62.86,23.88 v1(64.01,25.02) 63.5,25.53 63.5,26.03 62.3,27.23 R13.1 ; 63.17,16.89 63.17,17.32 63.64,17.79 63.64,19.57 63.88,19.81 63.88,21.59 v1(64.52,22.23)
  Top Layer w0.254: v1(64.01,25.02) 64.86,25.02 U3.8 ; v1(11.05,8.26) 10.41,8.26 10.2,8.47 C13.1 C12.1 10.59,10.18 U5.6
  Inner2 w0.254: v1(64.01,25.02) 64.01,23.5 63.63,23.11 62.36,23.11 61.05,21.81 61.05,20.92 60.45,20.32 60.45,14.73 62.36,12.83 62.36,11.3 61.47,10.41 57.4,10.41 56.39,9.4 53.34,9.4 52.32,10.41 42.55,10.41 39.24,7.11 33.4,7.11 32.26,8.26 32.26,11.56 30.51,13.31 29.44,13.31 25.91,9.78 25.91,8.51 24.26,6.86 12.45,6.86 v1(11.05,8.26)
  Bottom Layer w0.127: v1(64.01,25.02) 64.01,22.73 v1(64.52,22.23)
(no net):
  vias: v1(4.44,20.19) v1(5.72,20.19) v1(6.98,20.19) v1(13.46,27.81)
74HC595_DS: length 3.5
  Top Layer w0.127: U9.1 44.26,9.02 44.7,9.02 44.93,9.25 U1.21
74HC595_SHCP: length 3.1
  Top Layer w0.127: U12.1 47.12,8.79 47.12,9.02 47.47,9.37 U1.23
74HC595_STCP: length 3.1
  Top Layer w0.127: U1.22 46.2,9.42 46.61,9.02 46.61,8.83 U10.1
ADC_BATT: length 28.2
  Top Layer w0.127: v1(56.39,26.67) 55.75,27.31 54.61,27.31 54.11,26.8 U1.39 ; 68.77,11.68 68.83,11.74 v1(68.83,12.83)
  Inner2 w0.127: v1(56.39,26.67) 63.63,26.67 v1(64.01,26.29)
  Bottom Layer w0.127: v1(68.83,12.83) 68.83,17.4 66.55,19.69 66.55,21.46 64.77,23.24 64.77,25.53 v1(64.01,26.29)
ADC_BATT_EN: length 33.1
  Top Layer w0.127: 66.87,11.68 66.87,12.38 66.55,12.7 v1(64.14,12.7) 63.5,12.7 63.18,12.39 63.18,11.68 ; 66.87,11.68 66.8,11.61 ; 66.87,11.68 66.87,9.84 66.17,9.14 64.77,9.14 64.39,8.76 64.39,3.94 63.75,3.3 61.8,3.3 61.7,3.2 ; v1(56.64,20.32) 56.2,19.88 Q14.1
  Bottom Layer w0.127: v1(56.64,20.32) 57.28,19.69 59.82,19.69 60.33,19.18 60.33,16.26 60.71,15.88 62.99,15.88 63.5,15.37 63.5,13.46 64.26,12.7
ADC_LIGHT: length 46.4
  Top Layer w0.127: U1.38 52.08,25.53 v1(51.05,24.51)
  Inner2 w0.127: v1(40.64,24.51) 50.93,24.51
  Bottom Layer w0.127: 10.66,30.55 10.66,28.45 12.7,26.42 37.59,26.42 39.5,24.51 v1(40.64,24.51)
BTN_CHART: length 53.7
  Top Layer w0.127: v1(48.39,14.35) 50.01,12.73 U1.25
  Bottom Layer w0.127: 10.16,30.55 10.16,28.32 12.32,26.16 37.46,26.16 39.75,23.88 39.75,19.18 43.18,15.75 46.99,15.75 v1(48.39,14.35)
BTN_REC: length 53.3
  Top Layer w0.127: v1(47.5,14.35) 48.74,13.11 U1.24
  Bottom Layer w0.127: 9.66,30.55 9.66,28.2 11.95,25.91 37.34,25.91 39.5,23.75 39.5,19.05 43.05,15.49 46.36,15.49 v1(47.5,14.35)
BUTTON_CHK: length 20
  Top Layer w0.127: U1.26 51.28,13.23 v1(50.17,14.35) ; 59.44,19.89 58.73,19.89 58.29,20.32 v1(57.66,20.32) 57.15,20.83 Q14.3
  Inner2 w0.127: v1(57.66,20.32) 56.9,19.56 53.09,19.56 51.82,18.29 51.82,14.73 51.43,14.35 v1(50.17,14.35)
CHARGE_CHK+: length 82.6
  Top Layer w0.127: v1(17.65,4.32) 17.02,4.32 16.43,3.73 LED1.1 ; v1(62.86,15.11) 62.86,14.48 62.37,13.98 61.4,13.98 ; U1.33 52.08,19.18 51.05,18.16 v1(51.05,17.53)
  Bottom Layer w0.127: v1(51.05,17.53) 52.45,18.92 v1(57.02,18.92) 57.53,19.43 59.69,19.43 60.07,19.05 60.07,16.13 60.57,15.63 62.34,15.63 v1(62.86,15.11) 62.99,14.99 62.99,12.95 61.47,11.43 58.42,11.43 56.26,9.27 53.34,9.27 52.18,10.43 28.33,10.43 27.18,9.27 27.18,2.92 26.16,1.91 19.68,1.91 19.43,1.65 18.42,1.65 17.65,2.41 v1(17.65,4.32)
CHARGE_EN: length 32.8
  Top Layer w0.127: v1(64.52,21.34) 64.9,20.95 U3.1 64.22,19.65 64.01,19.43 64.01,17.78 63.75,17.53 63.75,16 63.63,15.88 63.17,15.88 ; v1(67.82,6.86) 67.06,6.86 66.87,7.05 66.87,7.91 ; v1(61.47,23.24) NOREF#2.TP1
  Bottom Layer w0.127: v1(61.47,23.24) 62.61,23.24 v1(64.52,21.34) 65.4,20.45 65.4,20.07 67.69,17.78 67.69,16.26 67.18,15.75 65.28,15.75 64.9,15.37 64.9,9.78 v1(67.82,6.86)
COMP_BATT: length 36.1
  Top Layer w0.127: 65.21,11.68 65.67,11.68 65.91,11.43 v1(65.91,10.41) ; R4.1 58.24,17.35 58.42,17.53 60.07,17.53 60.27,17.32 ; NOREF#13.TP2 63.63,22.86 65.15,22.86 65.79,22.23 v1(65.79,21.34) 66.17,20.95 U3.2 66.17,18.54 65.66,18.03 v1(65.53,18.03) ; 60.27,17.32 60.27,17.35 60.45,17.53 60.45,19.74 61.67,20.95 61.85,20.95 v1(62.23,21.34) ; 60.27,17.32 R8.2
  Bottom Layer w0.127: v1(65.79,21.34) 65.79,20.07 68.45,17.4 68.45,13.72 65.91,11.18 v1(65.91,10.41) ; v1(65.53,18.03) 65.53,19.18 64.01,20.7 62.86,20.7 v1(62.23,21.34)
DETECT: length 17.9
  Top Layer w0.127: CN1.20 24.81,7.42 25.15,7.75 25.53,7.75 25.78,8 25.78,8.76 25.65,8.89 U7.6 23.88,8.89 23.24,8.26 22.73,8.26 22.51,8.48 22.51,9.3 22.86,9.65 23.37,9.65 25.4,11.68 25.4,12.32 25.65,12.57 25.65,13.21 24.77,14.1 24.77,15.62 25.82,16.67 Q12.1
EN_EXT: length 32
  Top Layer w0.127: Q6.3 12.45,16.38 11.56,15.49 8.13,15.49 7.24,14.61 v1(7.24,11.81) ; v1(20.7,4.06) 21.46,4.06 21.81,3.71 CN1.7
  Inner2 w0.127: v1(20.7,4.06) 20.7,3.3 20.32,2.92 15.75,2.92 12.7,5.97 11.68,5.97 7.24,10.41 v1(7.24,11.81)
ENC_BANDRATE_A: length 41.4
  Top Layer w0.127: 33.15,14.73 33.15,15.37 32.89,15.62 32.45,15.62 ; 33.15,14.73 33.24,14.64 C16.1 35.01,14.64 U1.12 36.45,14.1 36.96,14.61 36.96,15.88 38.35,17.27 v1(38.35,17.91) ; 33.15,14.73 32.77,14.73 NOREF#11.TP22 ; v1(11.56,19.56) 11.56,18.28
  Bottom Layer w0.127: v1(38.35,17.91) 38.35,17.27 37.72,16.64 36.45,16.64 32.64,20.45 12.45,20.45 v1(11.56,19.56)
ENC_BANDRATE_B: length 59.6
  Top Layer w0.127: v1(4.06,25.4) 5.59,25.4 7.62,23.37 9.4,23.37 10.03,24 10.03,25.78 10.53,26.28 11.94,26.28 ; RN2.5 32.43,18.79 32.86,19.21 ; v1(37.46,18.54) 36.7,17.78 36.7,16.89 36.45,16.64 U1.10 34.67,16.64 34.42,16.89 34.42,19.18 34.38,19.21 C18.1 32.86,19.21 ; 32.86,19.21 NOREF#6.TP25
  Bottom Layer w0.127: v1(37.46,18.54) 35.31,18.54 32.89,20.95 6.6,20.95 4.06,23.5 v1(4.06,25.4)
ENC_BANDRATE_BTN: length 37.9
  Top Layer w0.127: v1(37.46,17.27) 36.7,16.51 36.7,15.62 36.45,15.37 U1.11 34.25,15.37 C17.1 33.31,15.84 33.15,16 33.15,16.38 32.9,16.63 RN2.6 ; 11.56,20.8 10.64,20.8 v1(10.03,20.19)
  Bottom Layer w0.127: v1(10.03,20.19) 10.54,20.7 32.77,20.7 36.2,17.27 v1(37.46,17.27)
ENC_LCD_A: length 18.8
  Top Layer w0.127: v1(51.05,16.26) 51.69,16.26 52.08,16.64 U1.31 53.98,16.64 54.23,16.89 54.23,19.05 54.39,19.21 C9.1 55.33,19.21 55.5,19.05 55.5,18.54 56.21,17.83 RN1.8
  Bottom Layer w0.127: 59.04,18.28 59.04,17 58.29,16.26 v1(51.05,16.26)
ENC_LCD_B: length 24
  Top Layer w0.127: RN1.5 55.76,15.63 55.5,15.37 55.5,14.86 55.28,14.64 C11.1 54.83,14.61 54.48,14.61 53.98,14.1 U1.29 51.94,14.1 v1(51.05,14.99)
  Bottom Layer w0.127: v1(51.05,14.99) 49.91,14.99 49.53,15.37 49.53,17.53 55.12,23.11 55.88,23.11 57.79,25.02 57.79,26.03 58.03,26.28 59.04,26.28
ENC_LCD_BTN: length 18.5
  Top Layer w0.127: 55.96,16.13 55.96,16.13 55.75,16.13 55.46,15.84 C10.1 54.45,15.84 53.98,15.37 U1.30 52.75,15.37 52.5,15.62 v1(50.17,15.62)
  Bottom Layer w0.127: 59.04,20.8 58.76,21.08 55.5,21.08 53.59,19.18 51.94,19.18 50.17,17.4 v1(50.17,15.62)
ESP32_EN: length 42.6
  Top Layer w0.127: v1(37.46,23.62) 37.46,25.02 36.96,25.53 35.55,25.53 U1.3 34.55,25.53 33.78,24.77 C5.1 34.25,24.04 34.42,23.88 34.42,21.84 34.21,21.64 R1.1 ; v1(29.72,18.92) 30.1,18.54 30.1,14.61 28.83,13.34 28.83,12.45 29.21,12.06 v1(30.73,12.06) ; v1(26.29,4.32) 26.29,4.04 26.01,3.76 24.21,3.76 23.81,3.37 CN1.15
  Inner2 w0.127: v1(30.73,12.06) 30.23,12.06 27.18,9.02 27.18,6.48 26.29,5.59 v1(26.29,4.32) ; v1(29.72,18.92) 32.77,18.92 v1(37.46,23.62)
ESP32_IO_0: length 39.4
  Top Layer w0.127: v1(53.98,10.16) 53.47,10.16 53.05,10.58 U1.27 ; v1(24.51,4.32) 24,4.32 23.31,3.63 CN1.13
  Bottom Layer w0.127: v1(53.98,10.16) 53.21,10.16 52.45,10.92 28.07,10.92 26.67,9.52 26.67,6.6 25.53,5.46 25.02,5.46 24.51,4.95 v1(24.51,4.32)
ESP32_RX: length 45.4
  Top Layer w0.127: CN1.9 22.31,3.26 22.59,3.54 22.59,3.96 v1(22.23,4.32) ; v1(44.58,14.35) 45.47,15.24 47.5,15.24 51.82,19.56 51.82,22.73 52.07,22.99 53.04,22.99 U1.36
  Bottom Layer w0.127: v1(44.58,14.35) 41.4,11.18 27.94,11.18 26.42,9.65 26.42,6.73 25.4,5.72 24.51,5.72 23.75,4.95 23.75,4.06 23.37,3.68 22.86,3.68 v1(22.23,4.32)
ESP32_TX: length 44.7
  Top Layer w0.127: v1(23.11,4.32) 22.81,4.02 CN1.11 ; U1.37 51.95,24.26 51.43,23.75 51.43,19.81 47.12,15.49 44.83,15.49 v1(43.69,14.35)
  Bottom Layer w0.127: v1(43.69,14.35) 40.77,11.43 27.81,11.43 26.16,9.78 26.16,6.86 25.27,5.97 24,5.97 23.11,5.08 v1(23.11,4.32)
IO0_EXT: length 34.7
  Top Layer w0.127: v1(8.13,11.81) 7.49,11.18 6.98,11.18 6.6,11.56 6.6,14.35 8,15.75 11.3,15.75 12.45,16.89 13.33,16.89 14.1,17.65 14.1,19.8 Q5.3 ; CN1.5 21.31,3.2 21.09,3.43 20.32,3.43 20.19,3.56 v1(19.56,3.56)
  Inner2 w0.127: v1(19.56,3.56) 15.62,3.56 12.95,6.22 11.75,6.22 8.13,9.85 v1(8.13,11.81)
LCD_BLK: length 43.3
  Top Layer w0.127: U1.9 36.45,17.91 36.7,18.16 36.7,18.8 37.08,19.18 37.97,19.18 38.99,20.19 38.99,21.08 v1(38.35,21.72)
  Bottom Layer w0.127: 8.66,30.55 8.66,27.91 11.43,25.15 37.21,25.15 38.99,23.37 38.99,22.35 v1(38.35,21.72)
LCD_CS: length 45.4
  Top Layer w0.127: U1.6 37.59,21.72 38.35,20.95 v1(38.35,20.45)
  Bottom Layer w0.127: 38.23,20.45 v1(38.35,20.45) 38.35,20.95 37.59,21.72 36.96,21.72 35.05,23.62 10.8,23.62 9.78,22.61 7.24,22.61 5.84,24 5.84,27.56 6.67,28.38 FPC1.4
LCD_DC: length 42.6
  Top Layer w0.127: U1.4 35.55,24.26 36.45,24.26 36.83,23.88 36.83,23.37 37.21,22.99 v1(38.35,22.99)
  Bottom Layer w0.127: v1(38.35,22.99) 37.21,22.99 35.56,24.64 10.41,24.64 9.4,23.62 7.75,23.62 6.86,24.51 6.86,27.05 7.67,27.86 FPC1.6
LCD_RES: length 43
  Top Layer w0.127: v1(37.46,21.08) 36.83,20.45 U1.7
  Bottom Layer w0.127: FPC1.3 6.17,28.64 5.33,27.81 5.33,23.75 6.98,22.1 9.91,22.1 10.92,23.11 34.8,23.11 36.83,21.08 v1(37.46,21.08)
LCD_SCL: length 41.2
  Top Layer w0.127: U1.5 36.44,22.99 37.08,22.35 v1(37.46,22.35)
  Bottom Layer w0.127: v1(37.46,22.35) 37.08,22.35 35.31,24.13 10.54,24.13 9.53,23.11 7.49,23.11 6.35,24.26 6.35,27.31 7.17,28.12 FPC1.5
LCD_SDA: length 44.2
  Top Layer w0.127: v1(37.46,19.81) 37.08,19.81 36.45,19.18 U1.8
  Bottom Layer w0.127: v1(37.46,19.81) 37.34,19.81 34.54,22.61 11.1,22.61 10.08,21.59 6.73,21.59 4.83,23.5 4.83,27.94 5.67,28.78 FPC1.2
LED_REC: length 52.3
  Top Layer w0.127: v1(41.91,15.62) 41.27,14.99 38.73,14.99 38.48,14.73 38.48,12.7 37.31,11.53 U1.15
  Bottom Layer w0.127: v1(41.91,15.62) 41.91,16.26 39.24,18.92 39.24,23.62 37.21,25.65 11.56,25.65 9.16,28.05 9.16,30.55
POWER_HOLD: length 14.6
  Top Layer w0.127: 63.31,7.91 63.22,8 62.36,8 59.82,10.54 57.4,10.54 56.39,9.53 55.24,9.53 54.86,9.91 R28.2 54.41,11.38 54.23,11.56 54.23,12.57 53.97,12.83 U1.28
RX+: length 86.3
  Top Layer w0.127: R2.2 54.92,23.24 55.37,23.24 55.63,22.99 v1(55.63,21.84) ; v1(21.46,7.62) 21.95,8.1 U7.4 ; U5.25 14.1,14.48 v1(14.48,14.86)
  Inner2 w0.127: v1(9.02,11.81) 9.91,10.92 18.16,10.92 v1(21.46,7.62) ; v1(40.13,16.26) 40.51,16.64 47.24,16.64 52.45,21.84 v1(55.63,21.84)
  Bottom Layer w0.127: v1(40.13,16.26) 36.07,16.26 32.26,20.07 13.59,20.07 11.3,17.78 8.89,17.78 6.98,15.88 6.98,13.84 7.87,12.95 8.51,12.95 9.02,12.45 v1(9.02,11.81) 9.02,11.3 9.27,11.05 10.16,11.05 10.67,11.56 10.67,12.57 12.32,14.22 13.84,14.22 v1(14.48,14.86)
RX_EXT: length 16.9
  Top Layer w0.127: U7.1 22.73,9.91 v1(23.11,10.29) ; v1(26.29,3.3) 25.27,3.3 25.15,3.43 24.44,3.43 24.31,3.3 CN1.17
  Bottom Layer w0.127: v1(26.29,3.3) 22.23,3.3 21.59,3.94 21.59,4.57 23.49,6.48 23.49,8.13 23.75,8.38 23.75,9.65 v1(23.11,10.29) 23.1,10.27 23,10.27
SD_CD: length 41.5
  Top Layer w0.127: U1.20 43.66,12.6 v1(41.91,14.35)
  Bottom Layer w0.127: v1(41.91,14.35) 40.01,12.45 35.18,12.45 30.86,16.76 27.05,16.76 18.92,8.64 18.92,6.48 15.6,3.15 14.67,3.15
SD_CLK: length 50.3
  Top Layer w0.127: v1(40.13,14.35) 41.12,13.36 U1.18
  Bottom Layer w0.127: 14.67,7.55 13.84,7.55 13.47,7.92 13.47,12.2 14.1,12.83 15.55,12.83 15.68,12.7 15.68,11.25 15.8,11.13 16.06,11.13 16.19,11.25 16.19,12.7 16.31,12.83 16.57,12.83 16.69,12.7 16.69,11.25 16.82,11.13 17.07,11.13 17.2,11.25 17.2,12.7 17.33,12.83 17.58,12.83 17.71,12.7 17.71,11.25 17.84,11.13 18.09,11.13 18.22,11.25 18.22,12.7 18.34,12.83 21.59,12.83 26.54,17.78 31.37,17.78 35.43,13.72 39.5,13.72 v1(40.13,14.35)
SD_CMD: length 57.2
  Top Layer w0.127: v1(16.89,5.33) 16.51,4.95 15.88,4.95 15.26,5.57 15.26,6.49 15.37,6.6 R6.1 ; v1(41.02,14.35) 42.39,12.98 U1.19
  Bottom Layer w0.127: 15.55,9.8 15.68,9.93 15.68,10.29 15.81,10.41 16.06,10.41 16.19,10.29 16.19,9.93 16.32,9.8 16.57,9.8 16.7,9.93 16.7,10.29 16.82,10.41 17.08,10.41 17.2,10.29 17.2,9.93 17.33,9.8 17.35,9.8 18.31,8.84 18.49,8.84 18.67,9.02 18.67,9.2 17.71,10.16 17.71,10.34 17.89,10.52 18.06,10.52 19.03,9.56 19.21,9.56 19.39,9.74 19.39,9.92 18.42,10.88 18.42,11.06 18.6,11.24 18.78,11.24 19.75,10.27 19.93,10.27 20.11,10.45 20.11,10.63 19.14,11.6 19.14,11.78 19.68,12.32 21.84,12.32 26.8,17.27 31.11,17.27 35.31,13.08 39.75,13.08 v1(41.02,14.35) ; 15.55,9.8 16.59,8.76 17.78,8.76 18.16,8.38 18.16,6.6 v1(16.89,5.33) ; 15.55,9.8 CARD1.3
SD_DATA0: length 50.3
  Top Layer w0.127: v1(16,4.32) 15.03,5.29 15.03,7.28 15.24,7.49 R3.1 ; U1.17 39.85,13.74 v1(39.24,14.35)
  Bottom Layer w0.127: v1(16,4.32) 16,4.95 15.55,5.4 CARD1.7 13.52,5.4 12.32,6.6 12.32,12.57 13.08,13.34 21.34,13.34 26.29,18.29 31.62,18.29 35.56,14.35 v1(39.24,14.35)
TX+: length 84.1
  Top Layer w0.127: U7.5 23.75,8.38 22.99,7.62 v1(22.35,7.62) ; v1(55.63,20.32) 55.63,21.08 55.32,21.39 R5.1 ; 13.6,13.68 13.6,14.47 v1(13.21,14.86)
  Inner2 w0.127: v1(9.91,11.81) 10.41,11.3 18.67,11.3 v1(22.35,7.62) ; v1(39.24,15.62) 40.26,15.62 40.89,16.26 47.5,16.26 51.56,20.32 v1(55.63,20.32)
  Bottom Layer w0.127: 9.02,13.34 9.65,13.97 11.43,13.97 12.32,14.86 v1(13.21,14.86) ; 9.02,13.34 8,13.34 7.37,13.97 7.37,15.75 9.02,17.4 11.43,17.4 13.72,19.69 32,19.69 36.07,15.62 v1(39.24,15.62) ; 9.02,13.34 9.91,12.45 v1(9.91,11.81)
TX_EXT: length 14.1
  Top Layer w0.127: U7.8 24,9.91 v1(23.11,9.02) ; CN1.19 25.35,2.37 v1(25.65,2.67)
  Bottom Layer w0.127: v1(25.65,2.67) 22.35,2.67 21.34,3.68 21.34,4.83 23.11,6.6 v1(23.11,9.02)
USB_DN: length 16
  Top Layer w0.127: USB1.B7 7.12,2.82 7.91,3.61 USB1.A7 7.91,4.29 7.76,4.44 7.76,8.42 7.85,8.51 7.84,8.51 7.75,8.6 7.75,9.02 arc(8.25,10.22) 9.45,10.72 10.97,10.72 11.02,10.68 U5.5
  Top Layer w0.254: D3.1 v1(6.86,9.78) ; 7.85,8.51 8,8.51 v1(8.25,8.26)
  Bottom Layer w0.254: v1(6.86,9.78) 7.87,9.78 8.25,9.4 v1(8.25,8.26)
USB_DP: length 16.2
  Top Layer w0.127: U5.4 11.02,11.18 10.97,11.13 9.45,11.13 arc(7.96,10.51) 7.34,9.02 7.34,8.6 7.25,8.51 7.26,8.51 7.35,8.42 7.35,4.47 7.12,4.24 USB1.A6 7.12,3.4 6.73,3.01 6.73,1.87 6.88,1.73 7.78,1.73 7.91,1.85 USB1.B6
  Top Layer w0.254: 7.25,8.51 6.89,8.51 6.76,8.64 D4.1
VOUT: length 22.8
  Top Layer w0.254: CN1.14 23.31,7.31 23.62,7.62 23.81,7.62 ; 23.81,7.62 CN1.16 ; 23.81,7.62 v1(24.13,7.62) 24.31,7.44 CN1.18
  Top Layer w0.762: Q8.2 26.1,20.13 25.53,19.56 v1(25.53,18.67)
  Inner2 w0.762: v1(29.46,16.13) 26.92,18.67 v1(25.53,18.67)
  Bottom Layer w0.762: v1(29.46,16.13) 25.91,12.57 25.91,11.5 24.51,10.1 24.51,8 v1(24.13,7.62)
VOUT_PRE: length 19.8
  Top Layer w0.127: NOREF#21.TP5 29.22,11.68 28,11.68 28,13.27 28.45,13.72 28.45,14.3
  Top Layer w0.254: 27.05,9.78 26.96,9.69 C20.2 25.82,9.69 25.53,9.4 U7.7 ; CN1.10 22.31,5.5 22.61,5.21 22.81,5.42 CN1.12
  Top Layer w0.508: 22.61,5.21 22.73,5.08 25.02,5.08 27.05,7.11 27.05,9.78 28,10.73 28,11.68
WS2812B_S1: length 48.2
  Top Layer w0.127: v1(40.64,28.07) 40.01,27.43 40.01,17.65 37.97,15.62 37.97,12.95 36.58,11.56 U1.14
  Bottom Layer w0.127: 15.66,30.55 15.66,30.1 17.4,30.1 18.29,29.21 22.99,29.21 24.58,27.62 32.83,27.62 35.56,30.35 39.12,30.35 40.64,28.83 v1(40.64,28.07)
WS2812B_S2: length 48
  Top Layer w0.127: v1(38.86,28.07) 39.5,27.43 39.5,17.78 37.46,15.75 37.46,13.46 36.83,12.83 U1.13
  Bottom Layer w0.127: 14.16,30.55 14.16,28.38 14.48,28.07 15.62,28.07 16.13,28.58 22.73,28.58 24.26,27.05 33.02,27.05 35.81,29.84 37.72,29.84 38.86,28.7 v1(38.86,28.07)
$1N2499: length 16.2
  Top Layer w0.127: Q9.2 21.85,16.76 22.73,15.88 22.73,13.84 21.84,12.95 20,12.95 19.3,13.65 19.3,14.3
  Top Layer w0.762: Q11.2 19.75,20.25 20.07,19.94 21.21,19.94 21.85,19.3 NOREF#19.TP8 Q9.2 23.13,17.33 D6.1
$1N3893: length 4.8
  Top Layer w0.762: Q11.3 Q10.3
$1N5725: length 5.4
  Top Layer w0.762: U11.1 24.25,25.41 24.26,25.41 27.03,25.41 D7.2
$1N6186: length 12.1
  Top Layer w0.127: R22.1 27.89,23.67 27.3,24.26 19.94,24.26 19.75,24.45 U11.3
  Top Layer w0.254: 28.45,24.71 R22.1 28.5,23.62 28.92,23.62 C25.1
$1N7254: length 13.2
  Top Layer w0.127: v1(6.35,6.6) 6.98,5.97 6.98,5.21 6.33,4.55 USB1.A5 ; R16.2 13.08,6.91 13.08,6.1 v1(12.32,5.33)
  Bottom Layer w0.127: v1(12.32,5.33) 11.3,4.32 8.64,4.32 v1(6.35,6.6)
$1N7256: length 12.1
  Top Layer w0.127: R14.1 13.66,5.66 v1(12.32,4.32) ; v1(7.75,0.76) 7.75,1.14 8.7,2.09 USB1.B5
  Bottom Layer w0.127: v1(7.75,0.76) 9.27,2.29 11.94,2.29 12.57,2.92 12.57,3.56 12.32,3.81 v1(12.32,4.32)
$1N10499: length 2.3
  Top Layer w0.127: R20.2 12.5,7.16 13.1,7.76 U5.9
$1N15423: length 5.4
  Top Layer w0.127: R7.1 64.34,15.44 61.4,12.51 U2.5
$1N15424: length 10.5
  Top Layer w0.127: v1(67.82,9.14) 67.82,10.38 ; v1(65.53,15.11) 65.2,15.44 65.2,15.88
  Bottom Layer w0.127: v1(65.53,15.11) 65.15,14.73 65.15,9.91 65.91,9.14 v1(67.82,9.14)
$1N23843: length 4.8
  Top Layer w0.762: Q7.3 Q8.3
$1N23847: length 13.4
  Top Layer w0.127: 26.1,11.68 26.1,12.51 26.42,12.83 27.11,12.83 27.81,13.53 27.81,15.62 28.07,15.88 28.07,16.16 Q12.3 28.45,16.22 R21.1
  Top Layer w0.254: Q8.1 28.7,21.09 29.08,20.7 29.08,16.89 28.58,16.38 Q12.3
$1N56207: length 55.6
  Top Layer w0.127: LED1.2 18.03,3.8 v1(18.54,4.32) ; 59.11,15.88 59.11,15.42 v1(58.8,15.11)
  Bottom Layer w0.127: v1(58.8,15.11) 58.8,12.19 56.13,9.53 53.47,9.53 52.32,10.67 28.19,10.67 26.92,9.4 26.92,3.05 26.01,2.13 19.96,2.13 18.54,3.56 v1(18.54,4.32)
$1N89822: length 14.6
  Top Layer w0.127: R17.2 8.51,12.83 8.13,13.21 v1(8.13,14.61) ; 16.24,15.43 16.24,16.02 v1(15.88,16.38)
  Bottom Layer w0.127: v1(8.13,14.61) 8.13,16 9.14,17.02 11.56,17.02 12.7,18.16 14.22,18.16 14.86,17.53 14.86,16.89 15.37,16.38 v1(15.88,16.38)
$1N89861: length 12.6
  Top Layer w0.127: R12.2 8.97,14.55 9.65,15.24 11.81,15.24 12.19,15.62 14.85,15.62 15.24,16.01 15.24,16.76 14.48,17.53 14.48,18.67 14.8,18.99 Q5.1
$1N92628: length 16.6
  Top Layer w0.127: 9.83,13.72 9.91,13.79 v1(9.91,14.61) ; v1(15.11,18.16) 16,18.16 16.24,17.92 Q6.2 ; v1(16.26,14.48) 14.89,14.48 14.6,14.19 U5.24
  Bottom Layer w0.127: v1(9.91,14.61) 10.8,15.49 14.73,15.49 15.75,14.48 v1(16.26,14.48) 16.26,15.75 16.64,16.13 16.64,16.64 v1(15.11,18.16)
$1N98999: length 3.6
  Top Layer w0.127: 64.26,13.98 Q2.3
$1N99171: length 21
  Top Layer w0.127: 65.2,16.89 65.2,17.27 65.33,17.4 65.79,17.4 66.04,17.14 66.04,15.49 66.39,15.15 Q4.1 66.87,15.94 67.18,16.26 67.95,16.26 69.34,17.65 69.34,21.97 68.07,23.24 68.07,26.16 67.18,27.05 D2.1 D1.1
$1N99677: length 26.3
  Top Layer w0.127: C8.1 64.81,27.69 v1(64.01,27.69) ; NOREF#14.TP3 63.12,23.24 65.53,23.24 v1(67.44,21.34) U3.3 ; 61.14,15.88 R11.1 R18.2 62.3,17.35 v1(62.74,17.78)
  Inner2 w0.127: v1(67.44,21.34) 67.44,21.08 66.29,19.94 64.9,19.94 v1(62.74,17.78)
  Bottom Layer w0.127: v1(64.01,27.69) 64.01,27.18 67.44,23.75 v1(67.44,21.34)
$1N111675: length 2.3
  Top Layer w0.127: 54.86,22.43 54.43,22.43 54.23,22.23 54.23,21.97 53.98,21.72 53.97,21.72 U1.35
$1N111682: length 1.8
  Top Layer w0.127: R5.2 53.12,20.52 U1.34
$1N112671: length 73.8
  Top Layer w0.127: v1(65.91,5.21) 65.91,3.94 66.65,3.2 68.45,3.2 ; v1(18.42,14.48) 18.42,14.99 18.59,15.17 R23.1 19.76,15.17 19.94,14.99 19.94,13.46 20.19,13.21 21.59,13.21 21.85,13.47 21.85,15.43 ; 64.26,10.38 64.26,9.65 v1(63.75,9.14) 61.6,9.14 59.94,10.8 56.52,10.8 v1(55.88,10.16)
  Inner2 w0.127: v1(18.42,14.48) 18.42,18.54 19.3,19.43 27.18,19.43 30.86,15.75 31.88,15.75 33.27,14.35 38.1,14.35 38.73,14.99 42.16,14.99 v1(42.8,14.35)
  Bottom Layer w0.127: v1(42.8,14.35) 43.43,14.99 45.72,14.99 49.53,11.18 52.58,11.18 52.96,10.8 54.23,10.8 54.86,10.16 v1(55.88,10.16) ; v1(65.91,5.21) 64.39,6.73 64.39,8.51 v1(63.75,9.14)
$1N115808: length 16.7
  Top Layer w0.127: 11.18,13.46 11.68,13.46 11.9,13.68 U5.28 ; 11.18,13.46 10.92,13.72 v1(10.92,14.61) ; 11.18,13.46 10.54,12.83 9.83,12.83 ; v1(12.83,21.97) 15.75,21.97 16.24,21.48 Q5.2
  Inner2 w0.127: v1(12.83,21.97) 12.83,16.51 v1(10.92,14.61)
$1N118922: length 12.6
  Top Layer w0.127: Q4.3 66.84,17.62 v1(66.42,18.03) ; 61.14,16.89 61.14,17.35 60.71,17.78 60.71,19.56 61.85,20.7 62.48,20.7 v1(63.12,21.34)
  Bottom Layer w0.127: v1(66.42,18.03) 66.42,18.67 63.75,21.34 v1(63.12,21.34)
$1N142909: length 6.4
  Top Layer w0.127: 63.17,27.81 63.17,27.25 63.5,26.92 64.26,26.92 64.77,26.42 67.18,26.42 67.44,26.16 U3.6
$1N142912: length 13.9
  Top Layer w0.127: R15.2 62.3,29.26 v1(61.85,29.72) ; v1(68.71,23.5) U3.5
  Bottom Layer w0.127: v1(68.71,23.5) 66.67,25.53 66.67,28.7 65.66,29.72 v1(61.85,29.72)

## Copper pours and planes (outline as drawn; the poured copper is in the pictures)
GND on Top Layer: -7.24,37.08 80.52,37.08 80.52,-5.33 -7.24,-5.33
GND on Bottom Layer: -1.91,41.53 72.39,41.53 72.39,-12.32 -1.91,-12.32
GND on Inner1: 0.26,31.23 70.36,31.23 70.36,0.26 0.26,0.26
GND on Inner2: -13.33,32.89 83.44,32.89 83.44,-2.03 -13.33,-2.03

Small or netless copper shapes (teardrops, artwork), in the pictures only: 9 on Inner1

## Text on the board
Bottom Solder Mask Layer: 20240103XM-2.51 | +
Bottom Silkscreen Layer: JLCJLCJLCJLC
Top Solder Mask Layer: ⭐️ SPECIAL EDITION ⭐️ | 💗 AMAGSTY | aDataFlow™️
